# EAGLE design Chest_ECG (EAGLE 9.6.1)
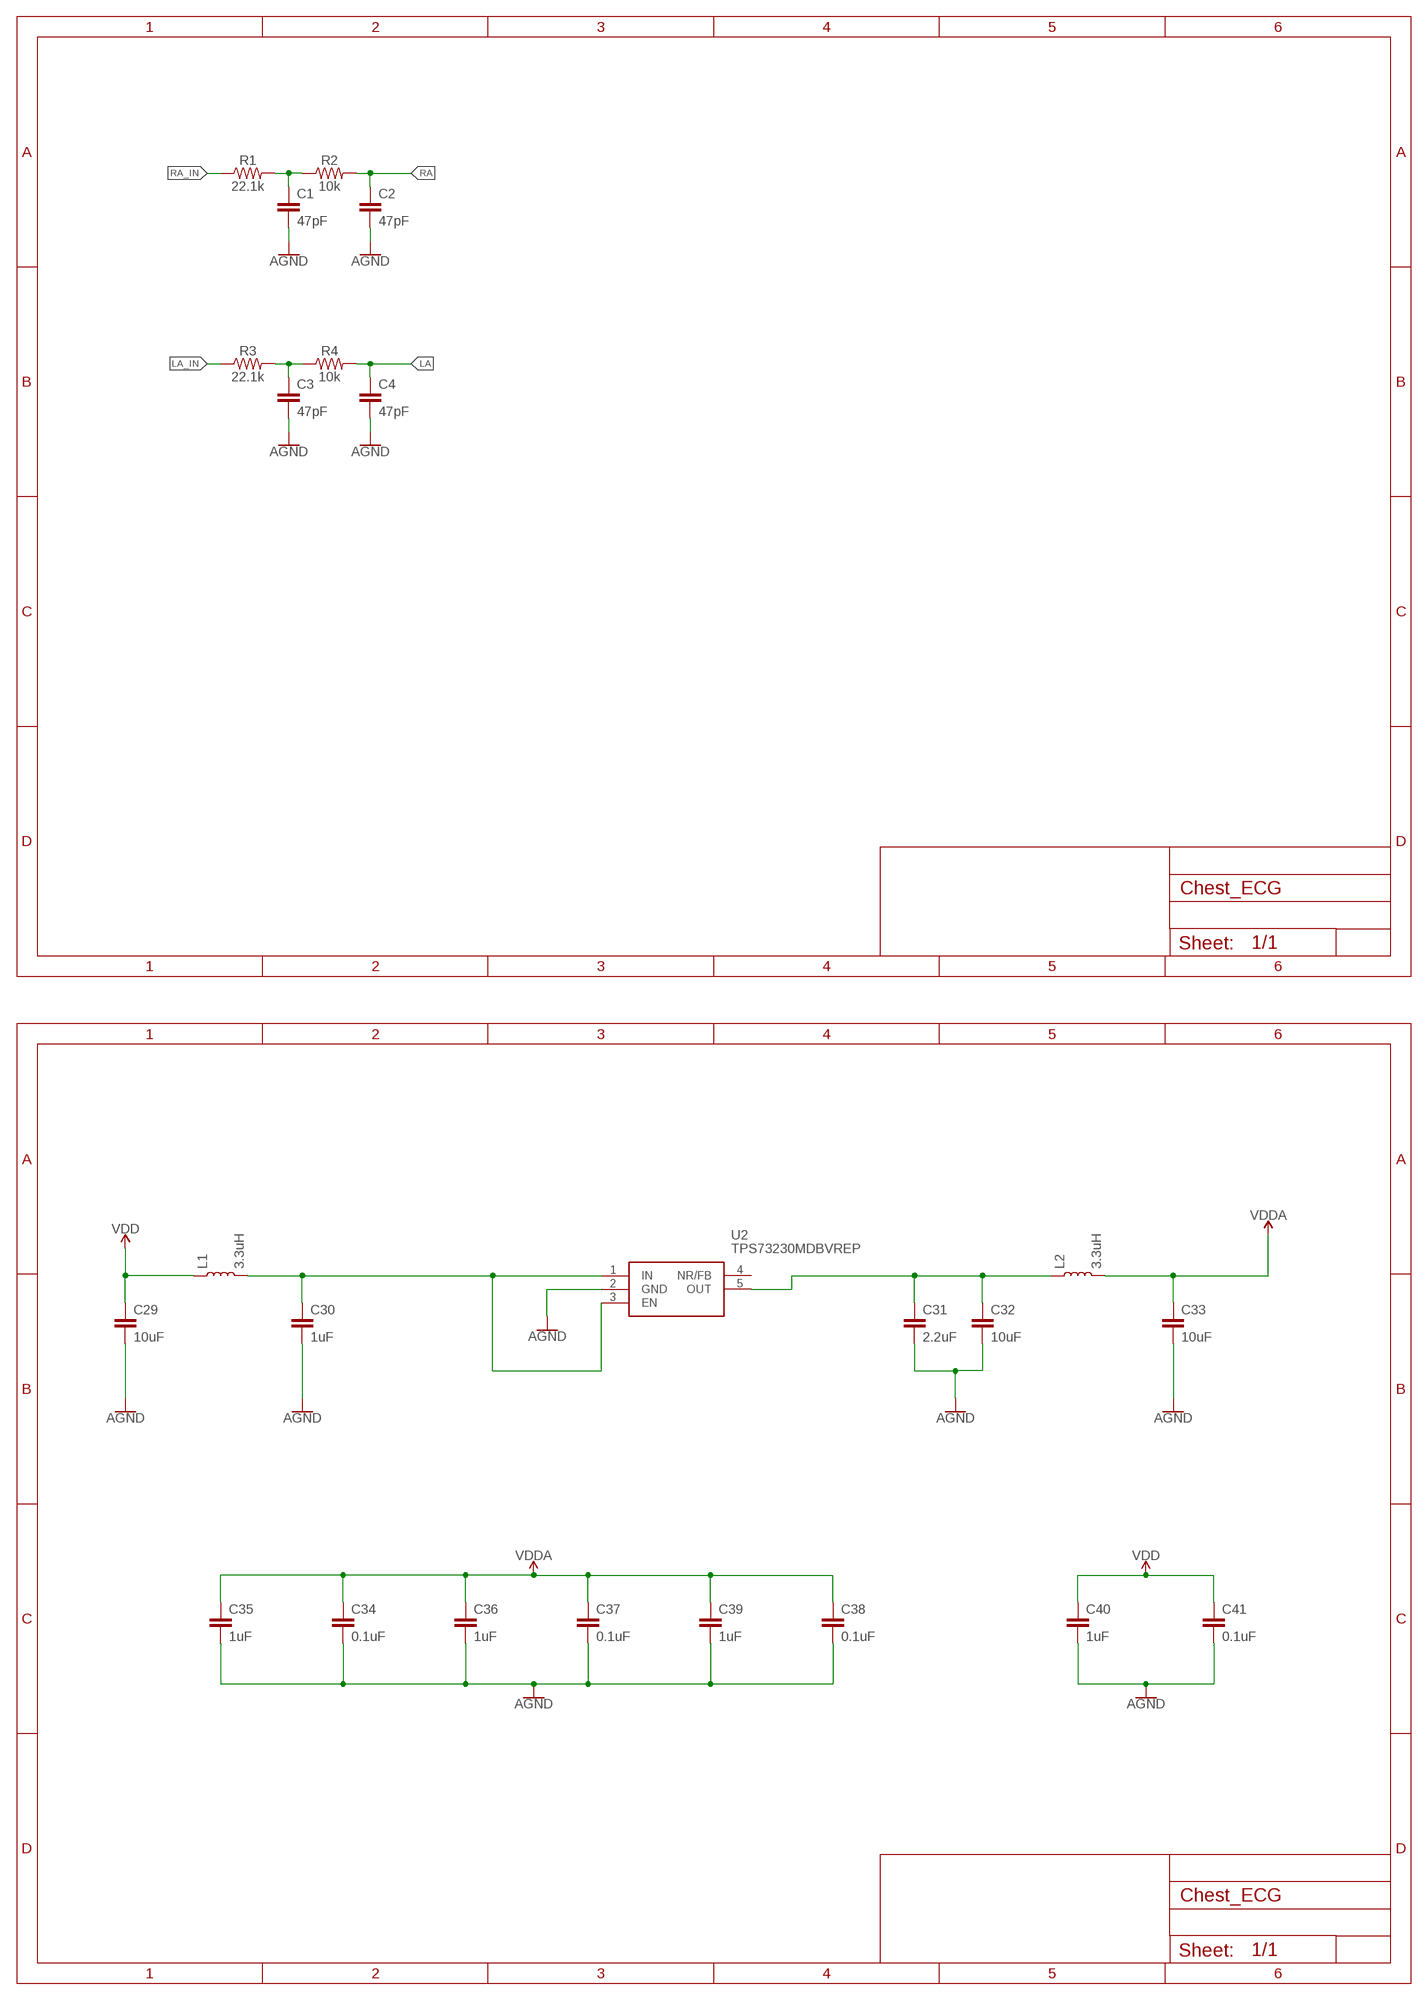
[diagram p0: schematic, sheet 1, part 1 of 2]
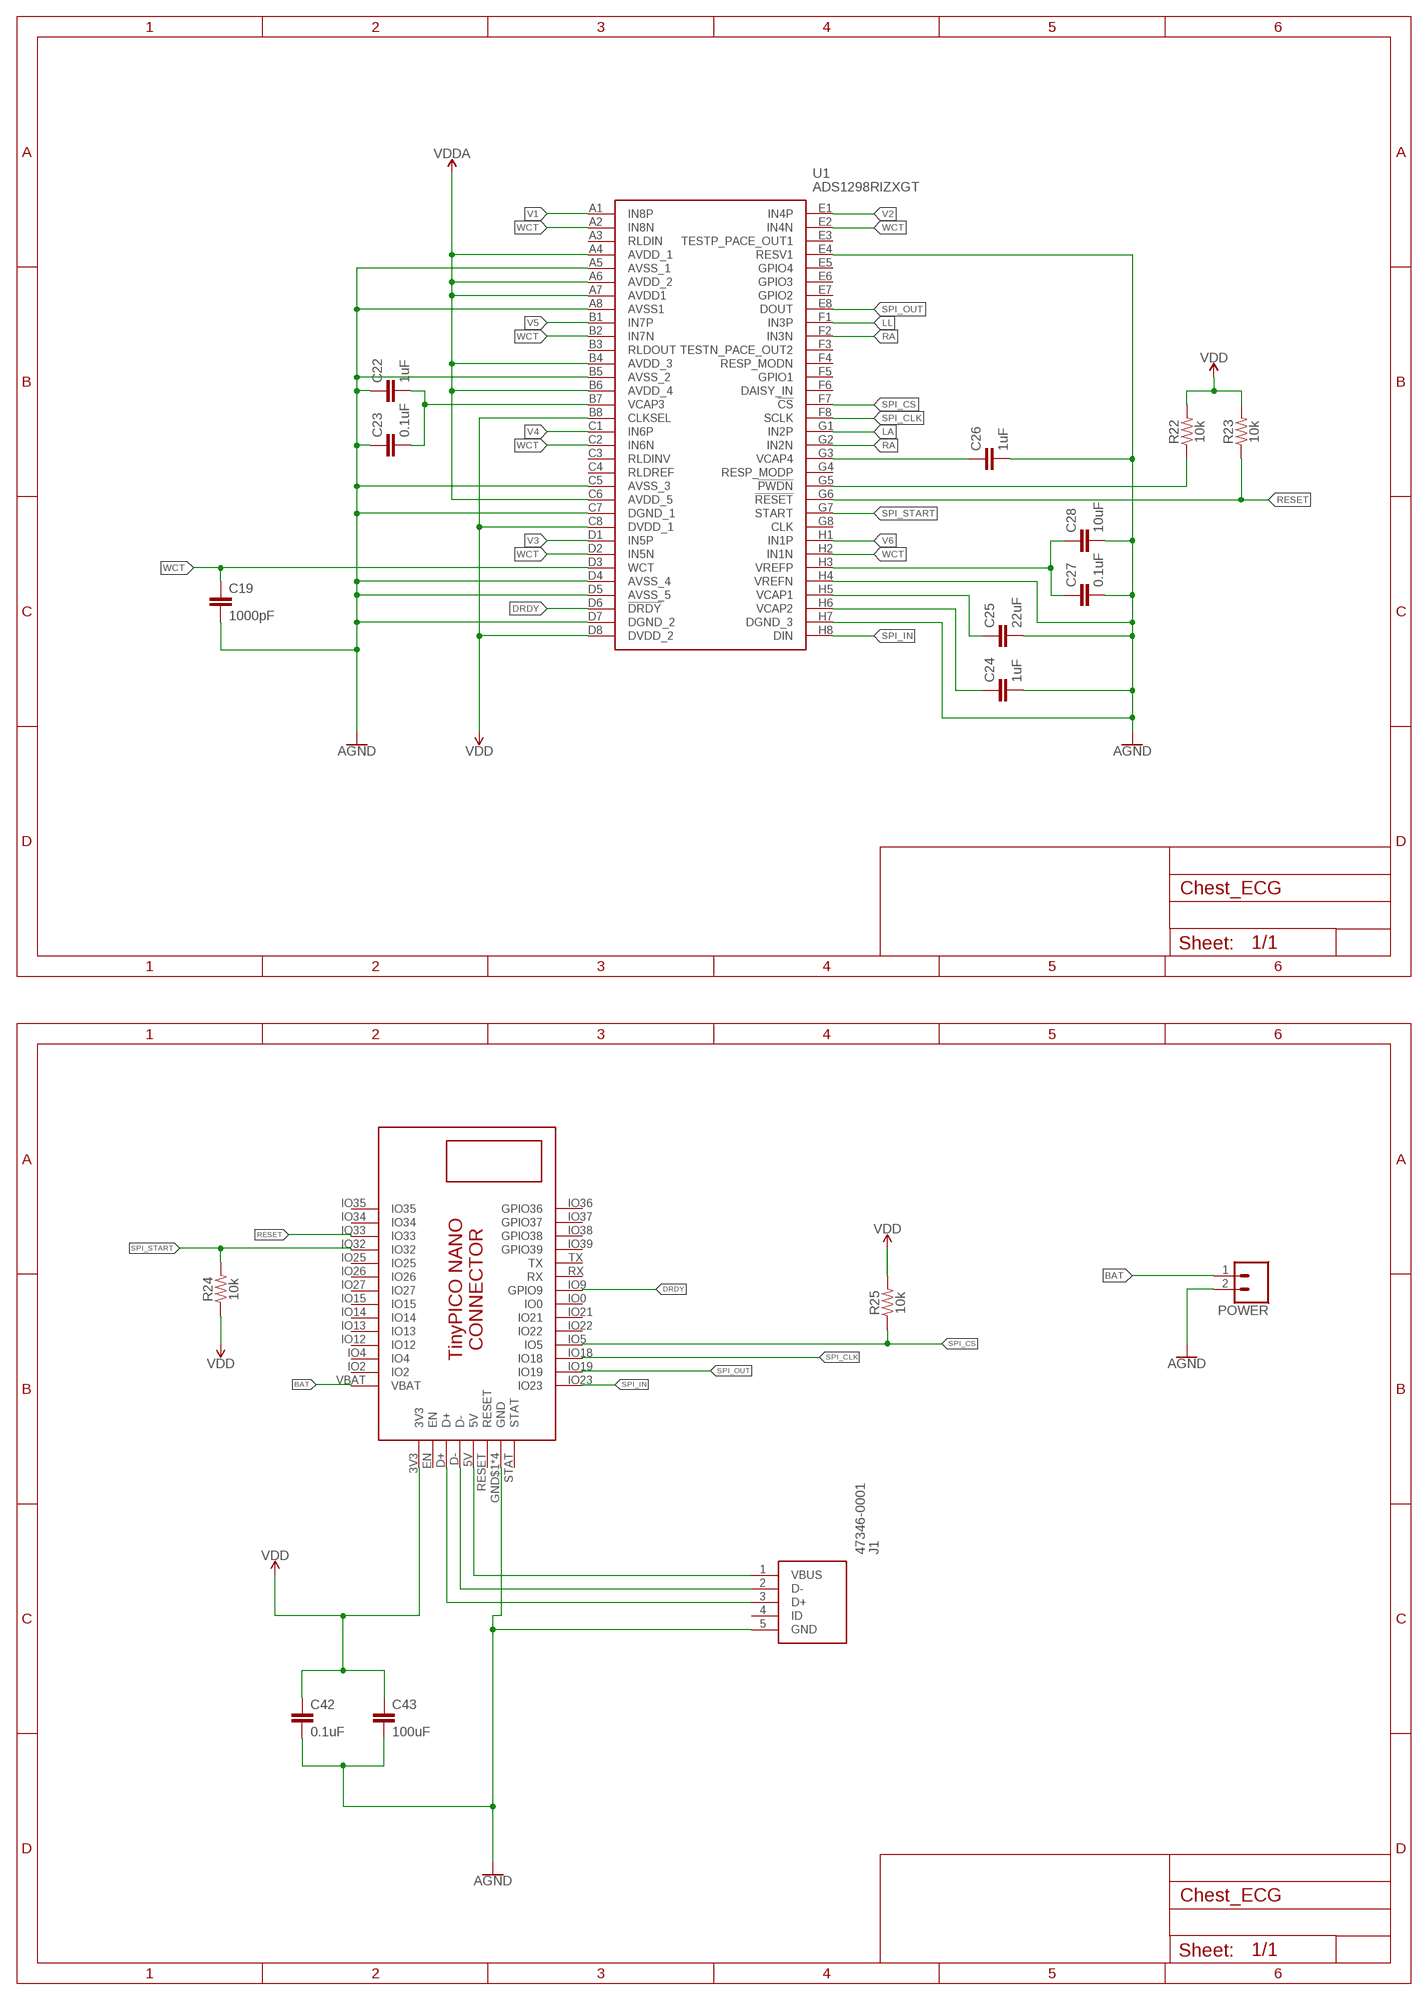
[diagram p1: schematic, sheet 1, part 2 of 2]

## Parts
C1  47pF  CAP-0603  [0603]
C2  47pF  CAP-0603  [0603]
C3  47pF  CAP-0603  [0603]
C4  47pF  CAP-0603  [0603]
C19  1000pF  CAP-0603  [0603]
C22  1uF  CAP-0603  [0603]
C23  0.1uF  CAP-0603  [0603]
C24  1uF  CAP-0603  [0603]
C25  22uF  CAP-0805  [0805]
C26  1uF  CAP-0603  [0603]
C27  0.1uF  CAP-0603  [0603]
C28  10uF  CAP-0805  [0805]
C29  10uF  CAP-0805  [0805]
C30  1uF  CAP-0603  [0603]
C31  2.2uF  CAP-0603  [0603]
C32  10uF  CAP-0805  [0805]
C33  10uF  CAP-0805  [0805]
C34  0.1uF  CAP-0603  [0603]
C35  1uF  CAP-0603  [0603]
C36  1uF  CAP-0603  [0603]
C37  0.1uF  CAP-0603  [0603]
C38  0.1uF  CAP-0603  [0603]
C39  1uF  CAP-0603  [0603]
C40  1uF  CAP-0603  [0603]
C41  0.1uF  CAP-0603  [0603]
C42  0.1uF  CAP-0603  [0603]
C43  100uF  CAP-0805  [0805]
J1  47346-0001  [47346-0001]
L1  3.3uH  INDUCTOR-0805-3.3UH  [0805]
L2  3.3uH  INDUCTOR-0805-3.3UH  [0805]
POWER  CONN_02  [1X02]
R1  22.1k  RESISTOR0603  [0603]
R2  10k  RESISTOR0603  [0603]
R3  22.1k  RESISTOR0603  [0603]
R4  10k  RESISTOR0603  [0603]
R22  10k  RESISTOR0603  [0603]
R23  10k  RESISTOR0603  [0603]
R24  10k  RESISTOR0603  [0603]
R25  10k  RESISTOR0603  [0603]
U1  ADS1298RIZXGT  [BGA64C80P8X8_800X800X145]
U2  TPS73230MDBVREP  [SOT95P280X145-5N]
U3  TINYPICO-NANO-CONNECTOR  [TINYPICO-NANO-CONNECTOR]

## Nets
AGND: C1.2 C2.2 C3.2 C4.2 C19.2 C22.1 C23.1 C24.2 C25.2 C26.2 C27.2 C28.2 C29.2 C30.2 C31.2 C32.2 C33.2 C34.2 C35.2 C36.2 C37.2 C38.2 C39.2 C40.2 C41.2 C42.2 C43.2 J1.5(GND) POWER.2 U1.A5(AVSS_1) U1.A8(AVSS1) U1.B5(AVSS_2) U1.C5(AVSS_3) U1.C7(DGND_1) U1.D4(AVSS_4) U1.D5(AVSS_5) U1.D7(DGND_2) U1.E4(RESV1) U1.H4(VREFN) U1.H7(DGND_3) U2.2(GND) U3.GND$1(GND) U3.GND$2(GND) U3.GND$3(GND) U3.GND$4(GND)
BAT: POWER.1 U3.VBAT
DRDY: U1.D6(!DRDY) U3.IO9(GPIO9)
LA: C4.1 R4.2 U1.G1(IN2P)
LA_IN: R3.1
LL: U1.F1(IN3P)
N$2: C1.1 R1.2 R2.1
N$4: C3.1 R3.2 R4.1
N$22: C22.2 C23.2 U1.B7(VCAP3)
N$23: R22.1 U1.G5(!PWDN)
N$24: C24.1 U1.H6(VCAP2)
N$25: C27.1 C28.1 U1.H3(VREFP)
N$26: C25.1 U1.H5(VCAP1)
N$27: C26.1 U1.G3(VCAP4)
N$29: C31.1 C32.1 L2.1 U2.5(OUT)
N$30: J1.3(D+) U3.D+
N$31: J1.2(D-) U3.D-
N$32: J1.1(VBUS) U3.5V
N$33: C30.1 L1.2 U2.1(IN) U2.3(EN)
RA: C2.1 R2.2 U1.F2(IN3N) U1.G2(IN2N)
RA_IN: R1.1
RESET: R23.1 U1.G6(!RESET) U3.IO33
SPI_CLK: U1.F8(SCLK) U3.IO18
SPI_CS: R25.1 U1.F7(!CS) U3.IO5
SPI_IN: U1.H8(DIN) U3.IO23
SPI_OUT: U1.E8(DOUT) U3.IO19
SPI_START: R24.2 U1.G7(START) U3.IO32
V1: U1.A1(IN8P)
V2: U1.E1(IN4P)
V3: U1.D1(IN5P)
V4: U1.C1(IN6P)
V5: U1.B1(IN7P)
V6: U1.H1(IN1P)
VDD: C29.1 C40.1 C41.1 C42.1 C43.1 L1.1 R22.2 R23.2 R24.1 R25.2 U1.B8(CLKSEL) U1.C8(DVDD_1) U1.D8(DVDD_2) U3.3V3
VDDA: C33.1 C34.1 C35.1 C36.1 C37.1 C38.1 C39.1 L2.2 U1.A4(AVDD_1) U1.A6(AVDD_2) U1.A7(AVDD1) U1.B4(AVDD_3) U1.B6(AVDD_4) U1.C6(AVDD_5)
WCT: C19.1 U1.A2(IN8N) U1.B2(IN7N) U1.C2(IN6N) U1.D2(IN5N) U1.D3(WCT) U1.E2(IN4N) U1.H2(IN1N)
Unconnected: J1.4(ID) U1.A3(RLDIN) U1.B3(RLDOUT) U1.C3(RLDINV) U1.C4(RLDREF) U1.E3(TESTP_PACE_OUT1) U1.E5(GPIO4) U1.E6(GPIO3) U1.E7(GPIO2) U1.F3(TESTN_PACE_OUT2) U1.F4(RESP_MODN) U1.F5(GPIO1) U1.F6(DAISY_IN) U1.G4(RESP_MODP) U1.G8(CLK) U2.4(NR/FB) U3.EN U3.IO0 U3.IO2 U3.IO4 U3.IO12 U3.IO13 U3.IO14 U3.IO15 U3.IO21 U3.IO22 U3.IO25 U3.IO26 U3.IO27 U3.IO34 U3.IO35 U3.IO36(GPIO36) U3.IO37(GPIO37) U3.IO38(GPIO38) U3.IO39(GPIO39) U3.RESET U3.RX U3.STAT U3.TX

## Library data of the parts
C1-C4 C19 C22-C43 = SparkFun-Capacitors:CAP
J1 = 47346-0001:47346-0001: Micro USB B Receptacle Bottom Mount Assy Molex Right Angle SMT Type B Version 2.0 Micro USB Connector Socket, 30 V ac, 1A 47352 MICRO-USB Source: Datasheet <http://www.molex.com/pdm_docs/sd/473460001_sd.pdf>; DESCRIPTION: Micro USB B Receptacle Bottom Mount Assy Molex Right Angle SMT Type B Version 2.0 Micro USB Connector Socket, 30 V ac, 1A 47352 MICRO-USB; HEIGHT: mm; MANUFACTURER_NAME: Molex; MANUFACTURER_PART_NUMBER: 47346-0001; MOUSER_PART_NUMBER: 538-47346-0001; MOUSER_PRICE-STOCK: https://www.mouser.co.uk/ProductDetail/Molex/47346-0001?qs=c2CV6XM0DweJBWaSeyWeCw%3D%3D
L1 L2 = SparkFun-Coils:INDUCTOR: Inductors Resist changes in electrical current. Basically a coil of wire. SparkFun Products: SparkFun Load Cell Amplifier - HX711 <https://www.sparkfun.com/products/13879> IOIO-OTG - V2.2 <https://www.sparkfun.com/products/13613>; PROD_ID: NDUC-13076; VALUE: 3.3µH/±20%/450mA
POWER = SparkFun-Connectors:CONN_02: Multi connection point. Often used as Generic Header-pin footprint for 0.1 inch spaced/style header connections On any of the 0.1 inch spaced packages, you can populate with these: Break Away Headers - Straight <https://www.sparkfun.com/products/116> (PRT-00116) Break Away Male Headers - Right Angle <https://www.sparkfun.com/products/553> (PRT-00553) Female Headers <https://www.sparkfun.com/products/115> (PRT-00115) Break Away Headers - Machine Pin <https://www.sparkfun.com/products/117> (PRT-00117) Break Away Female Headers - Swiss Machine Pin <https://www.sparkfun.com/products/743> (PRT-00743) For SCREWTERMINALS and SPRING TERMINALS visit here: Screw Terimnals on SparkFun.com <https://www.sparkfun.com/search/results?term=Screw+Terminals> (5mm/3.5mm/2.54mm spacing) This device is also useful as a general connection point to wire up your design to another part of your project. Our various solder wires solder well into these plated through hole pads. Hook-Up Wire - Assortment (Stranded, 22 AWG) <https://www.sparkfun.com/products/11375> (PRT-11375) Hook-Up Wire - Assortment (Solid Core, 22 AWG) <https://www.sparkfun.com/products/11367> (PRT-11367) View the entire wire category on our website here <https://www.sparkfun.com/categories/141> Special notes: Molex polarized connector foot print use with: PRT-08233 with associated crimp pins and housings. 2.54_SCREWTERM for use with PRT-10571. 3.5mm Screw Terminal footprints for PRT-08084 5mm Screw Terminal footprints for use with PRT-08432
R1-R4 R22-R25 = SparkFun-Resistors:RESISTOR: Generic Resistor Package
U1 = ADS1298RIZXGT:ADS1298RIZXGT: 8-Channel, 24-Bit Analog-To-Digital Converter w/Integrated Respiration Impedance and ECG Front End Source: Datasheet <http://www.ti.com/lit/gpn/ads1298r>; ARROW_PART_NUMBER: ADS1298RIZXGT; ARROW_PRICE-STOCK: https://www.arrow.com/en/products/ads1298rizxgt/texas-instruments; DESCRIPTION: 8-Channel, 24-Bit Analog-To-Digital Converter w/Integrated Respiration Impedance and ECG Front End; HEIGHT: 1.45mm; MANUFACTURER_NAME: Texas Instruments; MANUFACTURER_PART_NUMBER: ADS1298RIZXGT; MOUSER_PART_NUMBER: 595-ADS1298RIZXGT; MOUSER_PRICE-STOCK: https://www.mouser.co.uk/ProductDetail/Texas-Instruments/ADS1298RIZXGT/?qs=QtI0yD1FyOMXYlOc8kA39w%3D%3D
U2 = TPS73230MDBVREP:TPS73230MDBVREP: Enhanced Product Cap-Free Nmos 250-Ma Ldo Regulator With Reverse Current Protection Source: Datasheet <http://www.ti.com/lit/gpn/tps73230-ep>; ARROW_PART_NUMBER: TPS73230MDBVREP; ARROW_PRICE-STOCK: https://www.arrow.com/en/products/tps73230mdbvrep/texas-instruments; DESCRIPTION: Enhanced Product Cap-Free Nmos 250-Ma Ldo Regulator With Reverse Current Protection; HEIGHT: 1.45mm; MANUFACTURER_NAME: Texas Instruments; MANUFACTURER_PART_NUMBER: TPS73230MDBVREP; MOUSER_PART_NUMBER: 595-TPS73230MDBVREP; MOUSER_PRICE-STOCK: https://www.mouser.com/Search/Refine.aspx?Keyword=595-TPS73230MDBVREP
U3 = TinyPICO_NANO_Eagle:TINYPICO-NANO-CONNECTOR: TinyPICO NANO Footprint https://www.tinypico.com/tinypico-nano

## Board
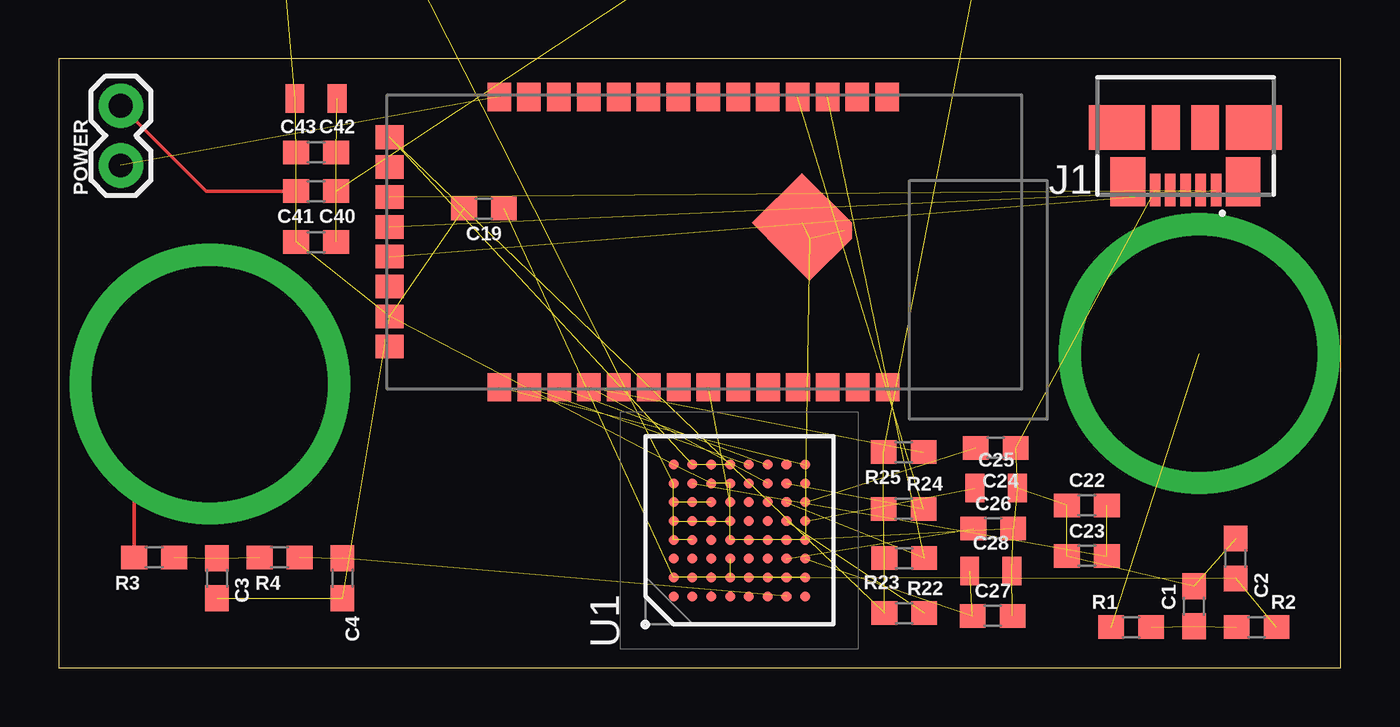
[diagram p2: board, top side]

Size 54.53 x 25.9 mm. Coordinates in mm from the lower left corner, seen from the top.
Outline: 0,0 54.53,0 54.53,25.9 0,25.9 0,0
Copper layers (1*16): Top 0.035mm / dielectric 1.5mm / Bottom 0.035mm
Design rules "default *": minimum track width 6mil, minimum drill 0.35mm, track to track 4mil, track to pad 4mil, pad to pad 4mil, via to via 4mil, smd to smd 4mil, copper to edge 40mil, drill to drill 6mil, minimum pad ring 10mil, minimum via ring 8mil, stop-mask expansion 4mil, vias tented up to drill 0mil, thermal gap 10mil

### Footprints (pad centres in the part's own frame; a part is rotated, then mirrored left to right if it is on the bottom)
0603 = smd 1.1 x 1: 1 -0.85,0; 2 0.85,0
0805 = smd 0.8 x 1.2: 1 -0.9,0; 2 0.9,0
47346-0001 = smd 0.45 x 1.38: 1 1.3,-4.81; 2 0.65,-4.81; 3 0,-4.81; 4 -0.65,-4.81; 5 -1.3,-4.81 | smd 1.475 x 2.1: 6 -2.453,-4.45; 7 2.453,-4.45 | smd 1.175 x 1.9: 8 0.838,-2.15; 9 -0.838,-2.15 | smd 2.375 x 1.9: 10 2.913,-2.15; 11 -2.913,-2.15
1X02 = drill 1.016 pad 1.88: 1 0,0; 2 2.54,0
BGA64C80P8X8_800X800X145 = smd 0.418 x 0.418: A1 -2.8,2.8; A2 -2,2.8; A3 -1.2,2.8; A4 -0.4,2.8; A5 0.4,2.8; A6 1.2,2.8; A7 2,2.8; A8 2.8,2.8; B1 -2.8,2; B2 -2,2; B3 -1.2,2; B4 -0.4,2; B5 0.4,2; B6 1.2,2; B7 2,2; B8 2.8,2; C1 -2.8,1.2; C2 -2,1.2; C3 -1.2,1.2; C4 -0.4,1.2; C5 0.4,1.2; C6 1.2,1.2; C7 2,1.2; C8 2.8,1.2; D1 -2.8,0.4; D2 -2,0.4; D3 -1.2,0.4; D4 -0.4,0.4; D5 0.4,0.4; D6 1.2,0.4; D7 2,0.4; D8 2.8,0.4; E1 -2.8,-0.4; E2 -2,-0.4; E3 -1.2,-0.4; E4 -0.4,-0.4; E5 0.4,-0.4; E6 1.2,-0.4; E7 2,-0.4; E8 2.8,-0.4; F1 -2.8,-1.2; F2 -2,-1.2; F3 -1.2,-1.2; F4 -0.4,-1.2; F5 0.4,-1.2; F6 1.2,-1.2; F7 2,-1.2; F8 2.8,-1.2; G1 -2.8,-2; G2 -2,-2; G3 -1.2,-2; G4 -0.4,-2; G5 0.4,-2; G6 1.2,-2; G7 2,-2; G8 2.8,-2; H1 -2.8,-2.8; H2 -2,-2.8; H3 -1.2,-2.8; H4 -0.4,-2.8; H5 0.4,-2.8; H6 1.2,-2.8; H7 2,-2.8; H8 2.8,-2.8
SOT95P280X145-5N = smd 1.2 x 0.6: 1 -1.25,0.95; 2 -1.25,0; 3 -1.25,-0.95; 4 1.25,-0.95; 5 1.25,0.95
TINYPICO-NANO-CONNECTOR = smd 1.2 x 1: 3V3 0.1,10.725; 5V 0.1,5.645; D+ 0.1,8.185; D- 0.1,6.915; EN 0.1,9.455; GND$1 0.1,3.105; RESET 0.1,4.375; STAT 0.1,1.835 | smd 3 x 3 rotated 45: GND$2 17.643,7.082 | smd 0.66 x 0.671: GND$3 19.436,6.746 | smd 2.54 x 2.54 rotated 45: GND$4 17.971,6.413 | smd 1 x 1.2: IO0 12.395,0.1; IO2 6.034,12.44; IO4 7.304,12.44; IO5 8.585,0.1; IO9 13.665,0.1; IO12 8.574,12.44; IO13 9.844,12.44; IO14 11.114,12.44; IO15 12.384,12.44; IO18 7.315,0.1; IO19 6.045,0.1; IO21 11.125,0.1; IO22 9.855,0.1; IO23 4.775,0.1; IO25 16.194,12.44; IO26 14.924,12.44; IO27 13.654,12.44; IO32 17.464,12.44; IO33 18.734,12.44; IO34 20.004,12.44; IO35 21.274,12.44; IO36 21.285,0.1; IO37 20.015,0.1; IO38 18.745,0.1; IO39 17.475,0.1; RX 14.935,0.1; TX 16.205,0.1; VBAT 4.764,12.44

### Placement (x,y rotation side)
C1  48.29,2.62 90 top
C2  50.06,4.65 90 top
C3  6.73,3.81 270 top
C4  12.06,3.81 270 top
C19  18.08,19.53 180 top
C22  43.74,6.91 0 top
C23  43.74,4.75 0 top
C24  39.85,9.35 0 top
C25  39.88,7.65 0 top
C26  39.75,5.92 0 top
C27  39.73,2.21 0 top
C28  39.65,4.11 0 top
C29  41,38.66 270 top  (outside the outline)
C30  38.58,38.53 270 top  (outside the outline)
C31  30.58,38.79 270 top  (outside the outline)
C32  28.17,38.91 270 top  (outside the outline)
C33  25.63,38.91 270 top  (outside the outline)
C34  9.09,39.95 90 top  (outside the outline)
C35  11.38,36.14 270 top  (outside the outline)
C36  9.09,36.14 270 top  (outside the outline)
C37  11.38,39.95 90 top  (outside the outline)
C38  6.81,39.95 90 top  (outside the outline)
C39  6.81,36.14 270 top  (outside the outline)
C40  10.95,18.11 180 top
C41  10.95,20.27 180 top
C42  10.95,21.92 180 top
C43  10.95,24.21 180 top
J1  47.93,25.12 0 top
L1  39.85,42.34 180 top  (outside the outline)
L2  28.17,42.34 180 top  (outside the outline)
POWER  2.64,21.36 90 top
R1  45.62,1.73 0 top
R2  50.95,1.73 0 top
R3  4.06,4.7 0 top
R4  9.4,4.7 0 top
R22  35.97,2.34 180 top
R23  35.97,4.67 180 top
R24  35.94,6.76 0 top
R25  35.94,9.17 180 top
U1  28.96,5.84 90 top
U2  34.39,40.31 180 top  (outside the outline)
U3  13.97,11.84 0 top

### Tracks (layer width: path | path; a pad name or v marks a point on that pad's centre or on a via)
AGND  (43 unrouted)
  Top 0.152: C41.2 6.27,20.27 POWER.2
BAT  (1 unrouted)
DRDY  (1 unrouted)
LA  (2 unrouted)
LA_IN  (via drill 10.03 pad 11.94)
  Top 0.152: R3.1 3.21,8.85 v6.43,12.06
N$2  (2 unrouted)
N$4  (2 unrouted)
N$22  (2 unrouted)
N$23  (1 unrouted)
N$24  (1 unrouted)
N$25  (2 unrouted)
N$26  (1 unrouted)
N$27  (1 unrouted)
N$29  (3 unrouted)
N$30  (1 unrouted)
N$31  (1 unrouted)
N$32  (1 unrouted)
N$33  (3 unrouted)
RA  (3 unrouted)
RA_IN  (via drill 10.03 pad 11.94)  (1 unrouted)
  other vias: 48.51,13.36
RESET  (2 unrouted)
SPI_CLK  (1 unrouted)
SPI_CS  (2 unrouted)
SPI_IN  (1 unrouted)
SPI_OUT  (1 unrouted)
SPI_START  (2 unrouted)
VDD  (13 unrouted)
VDDA  (13 unrouted)
WCT  (7 unrouted)